# EAGLE design IMU_TB (EAGLE 6.5.0)
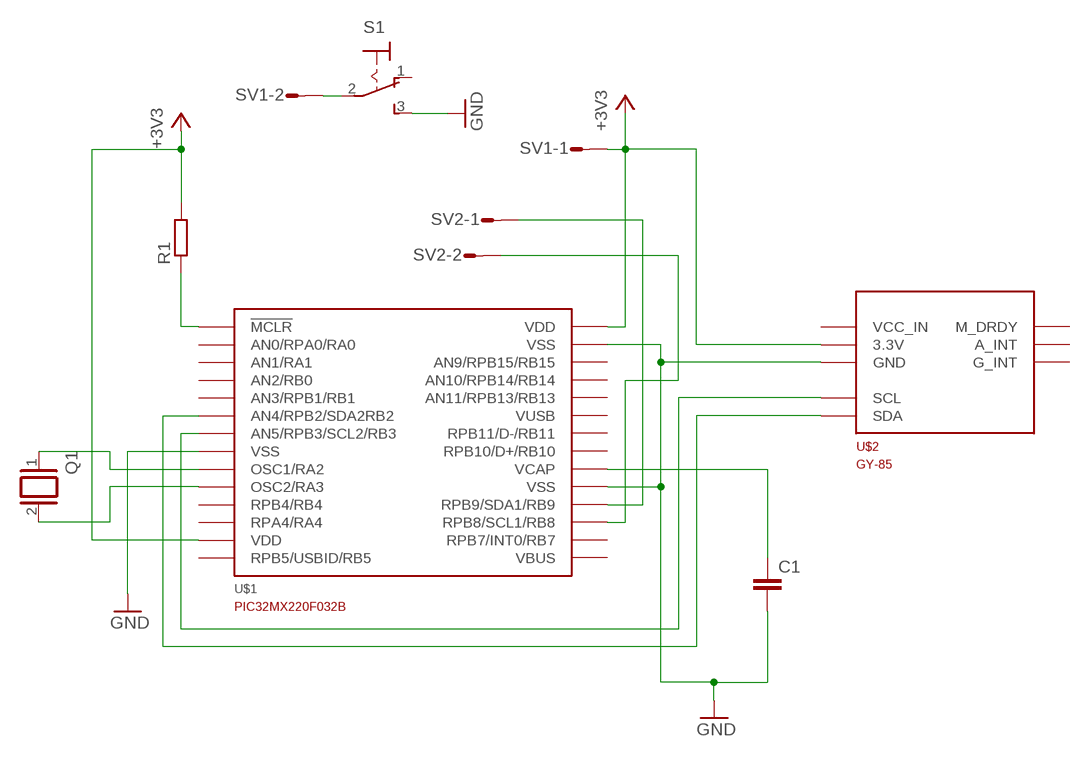
[diagram p0: schematic, sheet 1]

## Parts
C1  C2,5-3  [C2.5-3]
Q1  XTAL/S  [QS]
R1  R-EU_0204/5  [0204/5]
S1  320-916  [320-916]
SV1  S02P  [S02P]
SV2  S02P  [S02P]
U$1  PIC32MX220F032B  [DIP28]
U$2  GY-85  [GY-85]

## Nets
+3V3: R1.2 SV1.1 U$1.P$13(VDD) U$1.P$28(VDD) U$2.P$2(3.3V)
GND: C1.2 S1.3(S) U$1.P$8(VSS) U$1.P$19(VSS) U$1.P$27(VSS) U$2.P$3(GND)
N$1: R1.1 U$1.P$1(!MCLR!)
N$2: C1.1 U$1.P$20(VCAP)
N$3: U$1.P$7(AN5/RPB3/SCL2/RB3) U$2.P$4(SCL)
N$4: U$1.P$6(AN4/RPB2/SDA2RB2) U$2.P$5(SDA)
N$5: Q1.1 U$1.P$9(OSC1/RA2)
N$6: Q1.2 U$1.P$10(OSC2/RA3)
N$7: SV2.1 U$1.P$18(RPB9/SDA1/RB9)
N$8: SV2.2 U$1.P$17(RPB8/SCL1/RB8)
N$9: S1.2(P) SV1.2
Unconnected: S1.1(O) U$1.P$2(AN0/RPA0/RA0) U$1.P$3(AN1/RA1) U$1.P$4(AN2/RB0) U$1.P$5(AN3/RPB1/RB1) U$1.P$11(RPB4/RB4) U$1.P$12(RPA4/RA4) U$1.P$14(RPB5/USBID/RB5) U$1.P$16(RPB7/INT0/RB7) U$1.P$21(RPB10/D+/RB10) U$1.P$22(RPB11/D-/RB11) U$1.P$23(VBUS) U$1.P$24(AN11/RPB13/RB13) U$1.P$25(AN10/RPB14/RB14) U$1.P$26(AN9/RPB15/RB15) U$2.P$6(M_DRDY) U$2.P$7(A_INT) U$2.P$8(G_INT)

## Power pins joined to a net without a drawn wire
VCC_IN: U$2.P$1(VCC_IN)
VUSB: U$1.P$15(VUSB)

## Library data of the parts
C1 = capacitor-wima:C: CAPACITOR naming: grid - package width
Q1 = special:XTAL/S: CRYSTAL
R1 = resistor:R-EU_: RESISTOR, European symbol
S1 = switch:320-916: TOGGLE SWITCH distributor RS Components
SV1 SV2 = con-amp-mt:S02P: AMP MT CONNECTOR; OC_FARNELL: unknown; OC_NEWARK: unknown
U$1 = Minero:PIC32MX220F032B
U$2 = Minero:GY-85

## Board
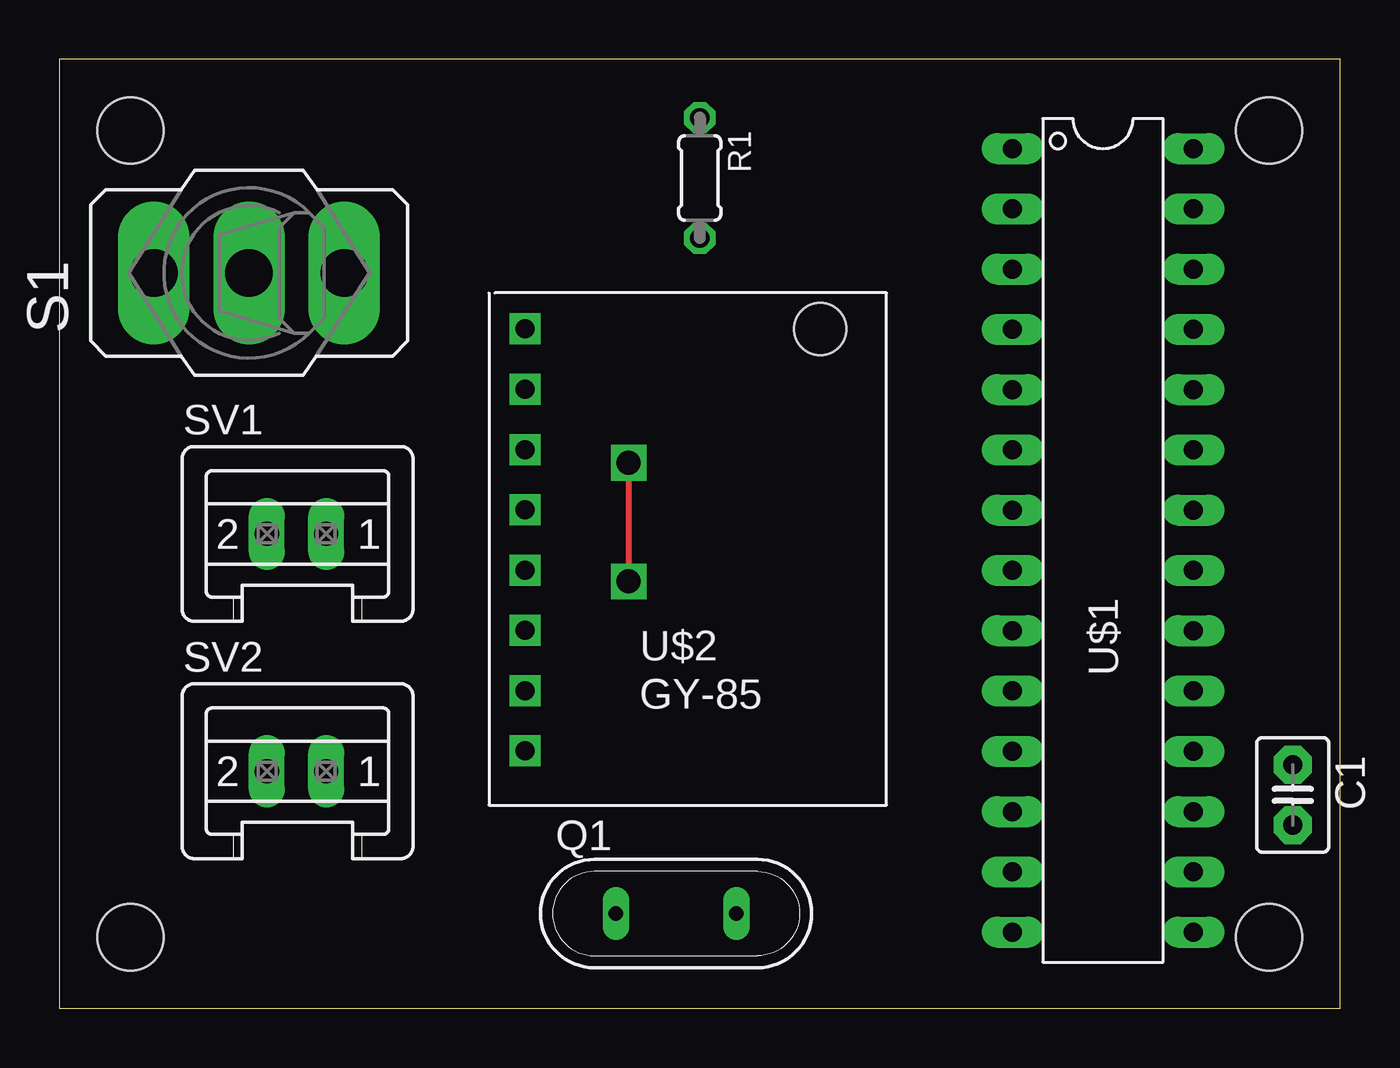
[diagram p1: board, top side]
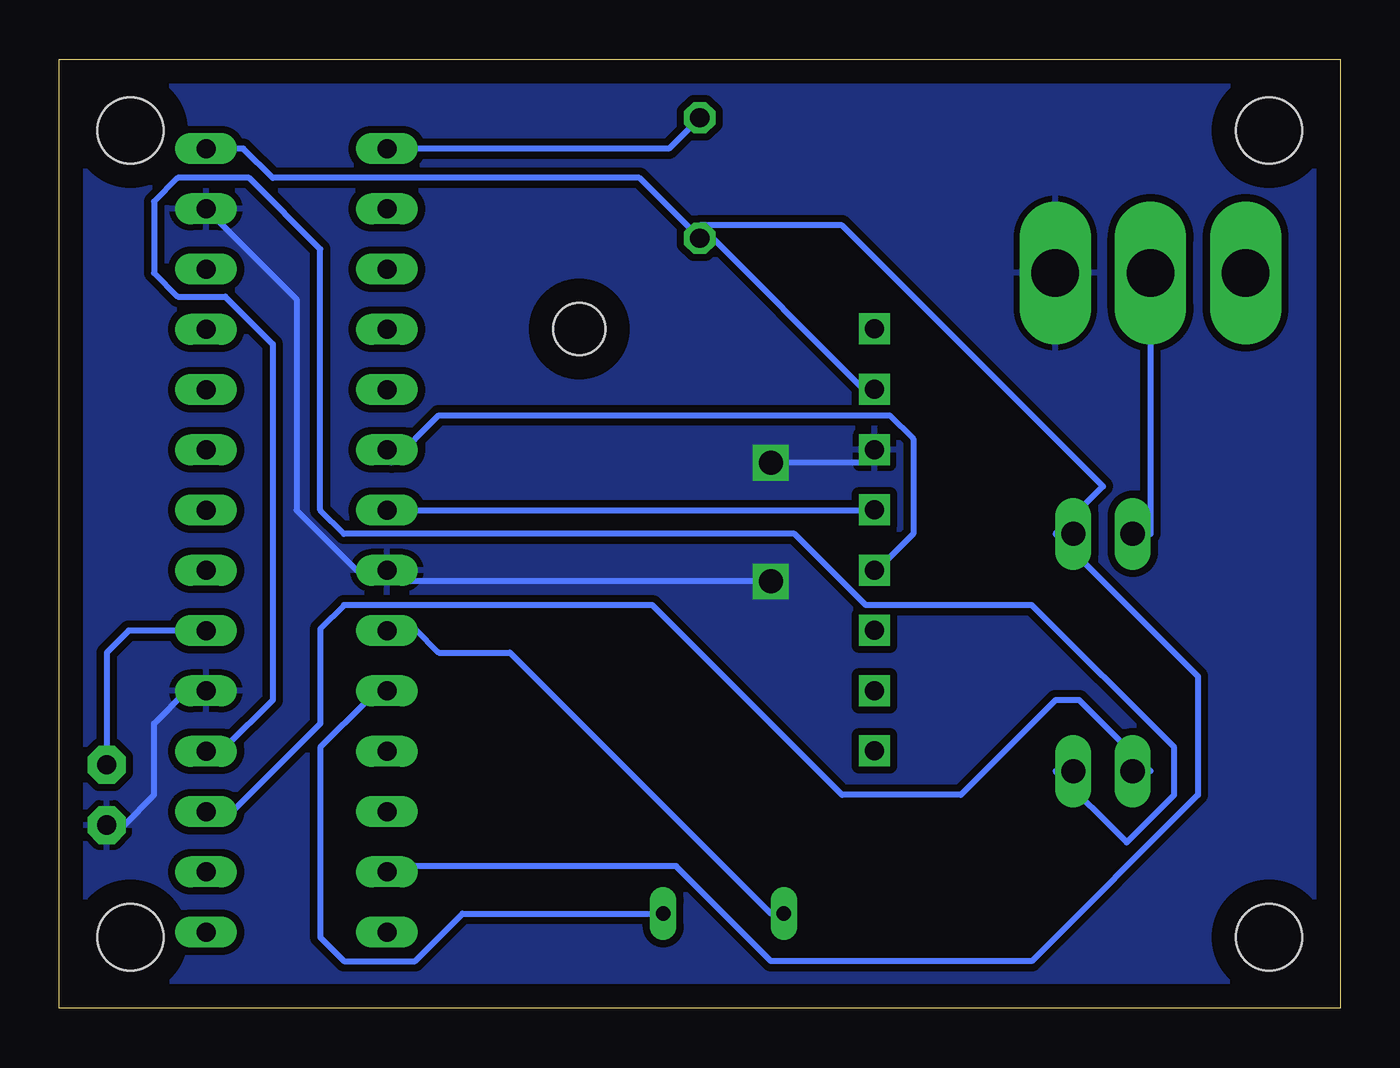
[diagram p2: board, bottom side, seen from below]

Size 54 x 40 mm. Coordinates in mm from the lower left corner, seen from the top.
Outline: 0,0 54,0 54,40 0,40 0,0
Copper layers (1*16): Top 0.035mm / dielectric 1.5mm / Bottom 0.035mm
Design rules "default": minimum track width 10mil, minimum drill 24mil, track to track 8mil, track to pad 8mil, pad to pad 8mil, via to via 8mil, smd to smd 8mil, copper to edge 40mil, drill to drill 8mil, minimum pad ring 10mil, minimum via ring 8mil, stop-mask expansion 4mil, vias tented up to drill 0mil, thermal gap 10mil
Holes 2.8 mm at 3,37 51,37 51,3 3,3

### Footprints (pad centres in the part's own frame; a part is rotated, then mirrored left to right if it is on the bottom)
C2.5-3 = drill 0.813 pad 1.6 octagon: 1 -1.27,0; 2 1.27,0
QS = drill 0.61 long: 1 -2.54,0; 2 2.54,0
0204/5 = drill 0.813 octagon: 1 -2.54,0; 2 2.54,0
320-916 = drill 2.007 long: 1 0,4.013; 2 0,0; 3 0,-4.013
S02P = drill 1.016 long: 1 1.25,0; 2 -1.25,0
DIP28 = drill 0.8 long: P$1 -3.81,15.24; P$2 -3.81,12.7; P$3 -3.81,10.16; P$4 -3.81,7.62; P$5 -3.81,5.08; P$6 -3.81,2.54; P$7 -3.81,0; P$8 -3.81,-2.54; P$9 -3.81,-5.08; P$10 -3.81,-7.62; P$11 -3.81,-10.16; P$12 -3.81,-12.7; P$13 -3.81,-15.24; P$14 -3.81,-17.78; P$15 3.81,-17.78; P$16 3.81,-15.24; P$17 3.81,-12.7; P$18 3.81,-10.16; P$19 3.81,-7.62; P$20 3.81,-5.08; P$21 3.81,-2.54; P$22 3.81,0; P$23 3.81,2.54; P$24 3.81,5.08; P$25 3.81,7.62; P$26 3.81,10.16; P$27 3.81,12.7; P$28 3.81,15.24
GY-85 = drill 0.8 square: P$1 -7.366,8.636; P$2 -7.366,6.096; P$3 -7.366,3.556; P$4 -7.366,1.016; P$5 -7.366,-1.524; P$6 -7.366,-4.064; P$7 -7.366,-6.604; P$8 -7.366,-9.144 | hole 2.2: 5.08,8.636

### Placement (x,y rotation side)
C1  52,9 270 top
Q1  26,4 0 top
R1  27,35 270 top
S1  8,31 90 top
SV1  10,20 0 top
SV2  10,10 0 top
U$1  44,21 0 top
U$2  27,20 0 top

### Tracks (layer width: path | path; a pad name or v marks a point on that pad's centre or on a via)
+3V3
  Bottom 0.254: U$1.P$28 46.24,36.24 45,35 29.54,35 R1.2 27,33 | 27,33 20,26 U$2.P$2 | 12,20 6,14 6,9 13,2 24,2 28,6 40,6 U$1.P$13 | 27,33 21,33 10,22 12,20 | 12,20 SV1.1
GND  (via drill 1)
  Top 0.254: v24,23 v24,18
  Bottom 0.254: U$1.P$27 44,29.89 44,21 41.46,18.46 U$1.P$8 40.19,18 v24,18 | C1.2 51.27,7.73 50,9 50,12 48.62,13.38 U$1.P$19 | U$2.P$3 19.63,23 v24,23
  pour Bottom (isolate 0.305): 0,40.01 54.05,40.01 54.05,0 0,0
N$1
  Bottom 0.254: R1.1 28.3,36.24 U$1.P$1
N$2
  Bottom 0.254: U$1.P$20 51.08,15.92 52,15 C1.1
N$3
  Bottom 0.254: U$1.P$7 20,21 U$2.P$4
N$4
  Bottom 0.254: U$2.P$5 19,19 18,20 18,24 19,25 38,25 40,23 U$1.P$6
N$5
  Bottom 0.254: Q1.1 24,4 35,15 38,15 39,16 40,16 U$1.P$9
N$6
  Bottom 0.254: Q1.2 37,4 39,2 42,2 43,3 43,11 41,13 U$1.P$10
N$7
  Bottom 0.254: U$1.P$18 47,11 45,13 45,28 47,30 49,30 50,31 50,34 49,35 46,35 43,32 43,21 42,20 23,20 20,17 13,17 7,11 7,9 9,7 12,10 SV2.1
N$8
  Bottom 0.254: U$1.P$17 47,8 43,12 43,16 42,17 29,17 21,9 16,9 12,13 11,13 8,10 SV2.2
N$9
  Bottom 0.254: S1.2 8,20 SV1.2